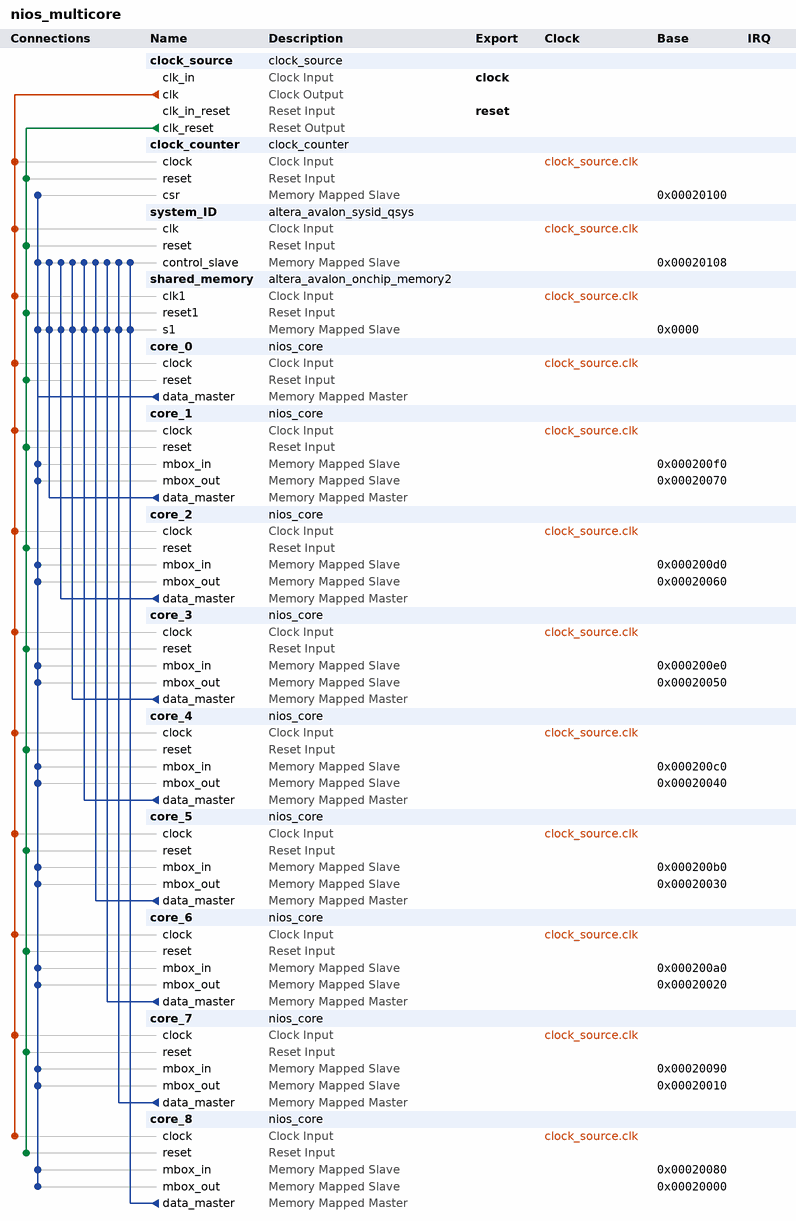
[diagram p0: system contents]
# Platform Designer (Qsys) system nios_multicore, Cyclone IV E EP4CE115F29C7
# Parameters at their usual value, and those the tool derives, are not listed.
package require -exact qsys 18.1
create_system nios_multicore
set_project_property DEVICE_FAMILY {Cyclone IV E}
set_project_property DEVICE EP4CE115F29C7

add_instance clock_source clock_source 18.1
set_instance_parameter_value clock_source clockFrequency 50000000

add_instance clock_counter clock_counter 1.0

add_instance system_ID altera_avalon_sysid_qsys 18.1
set_instance_parameter_value system_ID id -559038737

add_instance shared_memory altera_avalon_onchip_memory2 18.1
set_instance_parameter_value shared_memory dataWidth 32
set_instance_parameter_value shared_memory dualPort false
set_instance_parameter_value shared_memory initMemContent false
set_instance_parameter_value shared_memory initializationFileName onchip_mem.hex
set_instance_parameter_value shared_memory memorySize 131072

add_instance core_0 nios_core 1.0

add_instance core_1 nios_core 1.0

add_instance core_2 nios_core 1.0

add_instance core_3 nios_core 1.0

add_instance core_4 nios_core 1.0

add_instance core_5 nios_core 1.0

add_instance core_6 nios_core 1.0

add_instance core_7 nios_core 1.0

add_instance core_8 nios_core 1.0

# connections
add_connection clock_source.clk clock_counter.clock clock
add_connection clock_source.clk core_0.clock clock
add_connection clock_source.clk core_1.clock clock
add_connection clock_source.clk core_2.clock clock
add_connection clock_source.clk core_3.clock clock
add_connection clock_source.clk core_4.clock clock
add_connection clock_source.clk core_5.clock clock
add_connection clock_source.clk core_6.clock clock
add_connection clock_source.clk core_7.clock clock
add_connection clock_source.clk core_8.clock clock
add_connection clock_source.clk shared_memory.clk1 clock
add_connection clock_source.clk system_ID.clk clock
add_connection clock_source.clk_reset clock_counter.reset reset
add_connection clock_source.clk_reset core_0.reset reset
add_connection clock_source.clk_reset core_1.reset reset
add_connection clock_source.clk_reset core_2.reset reset
add_connection clock_source.clk_reset core_3.reset reset
add_connection clock_source.clk_reset core_4.reset reset
add_connection clock_source.clk_reset core_5.reset reset
add_connection clock_source.clk_reset core_6.reset reset
add_connection clock_source.clk_reset core_7.reset reset
add_connection clock_source.clk_reset core_8.reset reset
add_connection clock_source.clk_reset shared_memory.reset1 reset
add_connection clock_source.clk_reset system_ID.reset reset
add_connection core_0.data_master clock_counter.csr avalon
set_connection_parameter_value core_0.data_master/clock_counter.csr baseAddress 0x00020100
add_connection core_0.data_master core_1.mbox_in avalon
set_connection_parameter_value core_0.data_master/core_1.mbox_in baseAddress 0x000200f0
add_connection core_0.data_master core_1.mbox_out avalon
set_connection_parameter_value core_0.data_master/core_1.mbox_out baseAddress 0x00020070
add_connection core_0.data_master core_2.mbox_in avalon
set_connection_parameter_value core_0.data_master/core_2.mbox_in baseAddress 0x000200d0
add_connection core_0.data_master core_2.mbox_out avalon
set_connection_parameter_value core_0.data_master/core_2.mbox_out baseAddress 0x00020060
add_connection core_0.data_master core_3.mbox_in avalon
set_connection_parameter_value core_0.data_master/core_3.mbox_in baseAddress 0x000200e0
add_connection core_0.data_master core_3.mbox_out avalon
set_connection_parameter_value core_0.data_master/core_3.mbox_out baseAddress 0x00020050
add_connection core_0.data_master core_4.mbox_in avalon
set_connection_parameter_value core_0.data_master/core_4.mbox_in baseAddress 0x000200c0
add_connection core_0.data_master core_4.mbox_out avalon
set_connection_parameter_value core_0.data_master/core_4.mbox_out baseAddress 0x00020040
add_connection core_0.data_master core_5.mbox_in avalon
set_connection_parameter_value core_0.data_master/core_5.mbox_in baseAddress 0x000200b0
add_connection core_0.data_master core_5.mbox_out avalon
set_connection_parameter_value core_0.data_master/core_5.mbox_out baseAddress 0x00020030
add_connection core_0.data_master core_6.mbox_in avalon
set_connection_parameter_value core_0.data_master/core_6.mbox_in baseAddress 0x000200a0
add_connection core_0.data_master core_6.mbox_out avalon
set_connection_parameter_value core_0.data_master/core_6.mbox_out baseAddress 0x00020020
add_connection core_0.data_master core_7.mbox_in avalon
set_connection_parameter_value core_0.data_master/core_7.mbox_in baseAddress 0x00020090
add_connection core_0.data_master core_7.mbox_out avalon
set_connection_parameter_value core_0.data_master/core_7.mbox_out baseAddress 0x00020010
add_connection core_0.data_master core_8.mbox_in avalon
set_connection_parameter_value core_0.data_master/core_8.mbox_in baseAddress 0x00020080
add_connection core_0.data_master core_8.mbox_out avalon
set_connection_parameter_value core_0.data_master/core_8.mbox_out baseAddress 0x00020000
add_connection core_0.data_master shared_memory.s1 avalon
set_connection_parameter_value core_0.data_master/shared_memory.s1 baseAddress 0x0000
add_connection core_0.data_master system_ID.control_slave avalon
set_connection_parameter_value core_0.data_master/system_ID.control_slave baseAddress 0x00020108
add_connection core_1.data_master shared_memory.s1 avalon
set_connection_parameter_value core_1.data_master/shared_memory.s1 baseAddress 0x0000
add_connection core_1.data_master system_ID.control_slave avalon
set_connection_parameter_value core_1.data_master/system_ID.control_slave baseAddress 0x00020108
add_connection core_2.data_master shared_memory.s1 avalon
set_connection_parameter_value core_2.data_master/shared_memory.s1 baseAddress 0x0000
add_connection core_2.data_master system_ID.control_slave avalon
set_connection_parameter_value core_2.data_master/system_ID.control_slave baseAddress 0x00020108
add_connection core_3.data_master shared_memory.s1 avalon
set_connection_parameter_value core_3.data_master/shared_memory.s1 baseAddress 0x0000
add_connection core_3.data_master system_ID.control_slave avalon
set_connection_parameter_value core_3.data_master/system_ID.control_slave baseAddress 0x00020108
add_connection core_4.data_master shared_memory.s1 avalon
set_connection_parameter_value core_4.data_master/shared_memory.s1 baseAddress 0x0000
add_connection core_4.data_master system_ID.control_slave avalon
set_connection_parameter_value core_4.data_master/system_ID.control_slave baseAddress 0x00020108
add_connection core_5.data_master shared_memory.s1 avalon
set_connection_parameter_value core_5.data_master/shared_memory.s1 baseAddress 0x0000
add_connection core_5.data_master system_ID.control_slave avalon
set_connection_parameter_value core_5.data_master/system_ID.control_slave baseAddress 0x00020108
add_connection core_6.data_master shared_memory.s1 avalon
set_connection_parameter_value core_6.data_master/shared_memory.s1 baseAddress 0x0000
add_connection core_6.data_master system_ID.control_slave avalon
set_connection_parameter_value core_6.data_master/system_ID.control_slave baseAddress 0x00020108
add_connection core_7.data_master shared_memory.s1 avalon
set_connection_parameter_value core_7.data_master/shared_memory.s1 baseAddress 0x0000
add_connection core_7.data_master system_ID.control_slave avalon
set_connection_parameter_value core_7.data_master/system_ID.control_slave baseAddress 0x00020108
add_connection core_8.data_master shared_memory.s1 avalon
set_connection_parameter_value core_8.data_master/shared_memory.s1 baseAddress 0x0000
add_connection core_8.data_master system_ID.control_slave avalon
set_connection_parameter_value core_8.data_master/system_ID.control_slave baseAddress 0x00020108

# exported interfaces
add_interface clock clock sink
set_interface_property clock EXPORT_OF clock_source.clk_in
add_interface reset reset sink
set_interface_property reset EXPORT_OF clock_source.clk_in_reset

set_interconnect_requirement {$system} qsys_mm.clockCrossingAdapter HANDSHAKE
set_interconnect_requirement {$system} qsys_mm.enableEccProtection FALSE
set_interconnect_requirement {$system} qsys_mm.insertDefaultSlave FALSE
set_interconnect_requirement {$system} qsys_mm.maxAdditionalLatency 1

save_system nios_multicore.qsys
